# Altium schematic sheet anafun.SchDoc
size A4
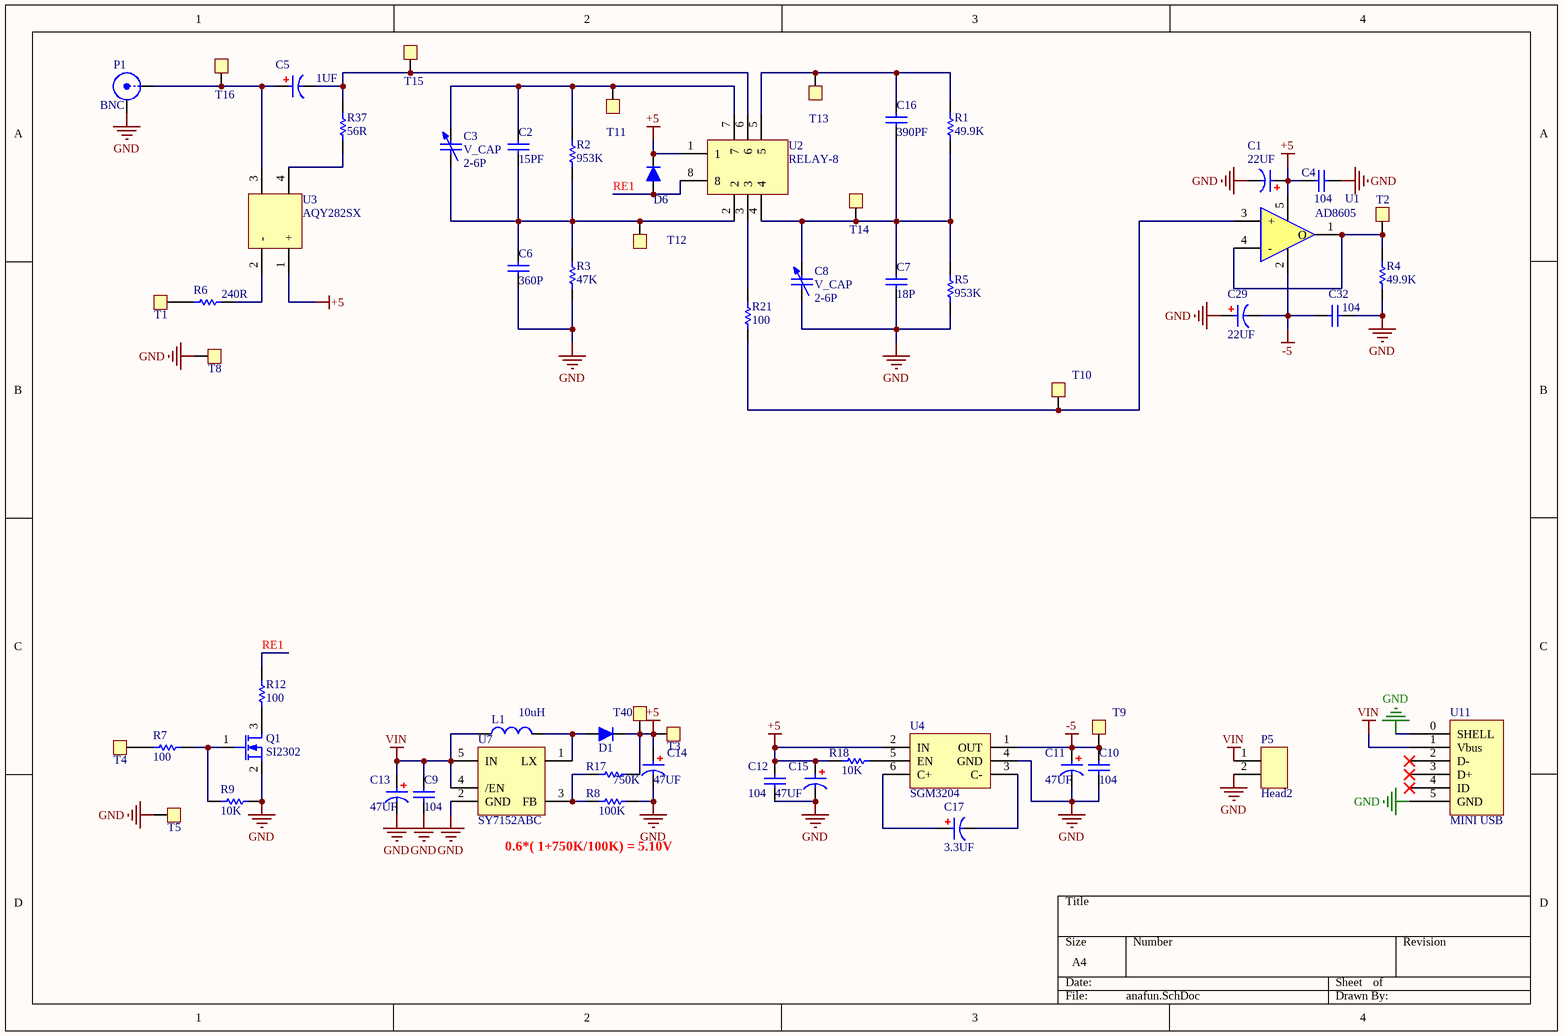
[diagram p0: anafun.SchDoc]

## Parts
C1  22UF  [0603C]
C2  15PF  [0603C]
C3  V_CAP  value 2-6P  [V-CAP]
C4  C104  [0603C]  (value not drawn)
C5  1UF  [1812]
C6  360P  [0603C]
C7  18P  [0603C]
C8  V_CAP  value 2-6P  [V-CAP]
C9  C104  [0603C]  (value not drawn)
C10  C104  [0603C]  (value not drawn)
C11  47UF  [CAP-T-3216]
C12  C104  [0603C]  (value not drawn)
C13  47UF  [CAP-T-3216]
C14  47UF  [CAP-T-3216]
C15  47UF  [CAP-T-3216]
C16  390PF  [0603C]
C17  3.3UF  [0603C]
C29  22UF  [0603C]
C32  C104  [0603C]  (value not drawn)
D1  1N5918WS  [SOD23-322F]  (value not drawn)
D6  BAT54WS  [LC-SOD-323F]  (value not drawn)
L1  10uH  [0805]
P1  BNC  [BNC-OSC]
P5  Head2  [HEAD2]
Q1  SI2302  [SOT-23-3]
R1  49.9K  [0603R]
R2  953K  [0603R]
R3  47K  [0603R]
R4  49.9K  [0603R]
R5  953K  [0603R]
R6  240R  [0603R]
R7  R100R  [0603R]  (value not drawn)
R8  100K  [0603R]
R9  R10K  [0603R]  (value not drawn)
R12  R100R  [0603R]  (value not drawn)
R17  750K  [0603R]
R18  R10K  [0603R]  (value not drawn)
R21  R100R  [0603R]  (value not drawn)
R37  56R  [0603R]
T1  TP  [TEST_POINT]  (value not drawn)
T2  TP  [TEST_POINT]  (value not drawn)
T3  TP  [TEST_POINT]  (value not drawn)
T4  TP  [TEST_POINT]  (value not drawn)
T5  TP  [TEST_POINT]  (value not drawn)
T8  TP  [TEST_POINT]  (value not drawn)
T9  TP  [TEST_POINT]  (value not drawn)
T10  TP  [TEST_POINT]  (value not drawn)
T11  TP  [TEST_POINT]  (value not drawn)
T12  TP  [TEST_POINT]  (value not drawn)
T13  TP  [TEST_POINT]  (value not drawn)
T14  TP  [TEST_POINT]  (value not drawn)
T15  TP  [TEST_POINT]  (value not drawn)
T16  TP  [TEST_POINT]  (value not drawn)
T40  TP  [TEST_POINT]  (value not drawn)
U1  AD8605  [SOT23-5]
U2  RELAY-8  [RELAY-GS6-8]
U3  AQY282SX  [SOP4]
U4  SGM3204  [SOT23-6]
U7  SY7152ABC  [SOT23-6]
U11  MINI USB  [Micro_USB_t]

## Nets
+5: C1.1 C4.1 C12.1 C14.1 C15.1 D1.2(K) D6.2(K) R17.2 R18.1 T3.1(R) T40.1(R) U1.5(V+) U2.1 U3.1(+) U4.2(IN)
-5: C10.1 C11.1 C29.2 C32.1 T9.1(R) U1.2(V-) U4.1(OUT)
GND: C1.2 C4.2 C6.2 C7.2 C8.1 C9.2 C10.2 C11.2 C12.2 C13.2 C14.2 C15.2 C29.1 C32.2 P1.2(Y) P5.2 Q1.2(S) R3.2 R4.2 R5.2 R8.1 R9.2 T5.1(R) T8.1(R) U4.4(GND) U7.2(GND) U11.0(SHELL) U11.5(GND)
VIN: C9.1 C13.1 L1.1 P5.1 U7.4(/EN) U7.5(IN) U11.1(Vbus)
RE1: D6.1(A) R12.1 U2.8
NetC2_1: C2.1 C3.2 R2.1 T11.1(R) U2.7
NetC2_2: C2.2 C3.1 C6.1 R2.2 R3.1 T12.1(R) U2.2
NetC5_1: C5.1 P1.1(X) T16.1(R) U3.3
NetC5_2: C5.2 R37.1 T15.1(R) U2.6
NetC7_1: C7.1 C8.2 C16.2 R1.2 R5.1 T14.1(R) U2.4
NetC16_1: C16.1 R1.1 T13.1(R) U2.5
NetC17_1: C17.1 U4.6(C+)
NetC17_2: C17.2 U4.3(C-)
NetD1_1: D1.1(A) L1.2 U7.1(LX)
NetQ1_1: Q1.1(G) R7.2 R9.1
NetQ1_3: Q1.3(D) R12.2
NetR4_1: R4.1 T2.1(R) U1.1(O) U1.4(-)
NetR6_1: R6.1 T1.1(R)
NetR6_2: R6.2 U3.2(-)
NetR7_1: R7.1 T4.1(R)
NetR8_2: R8.2 R17.1 U7.3(FB)
NetR18_2: R18.2 U4.5(EN)
NetR21_1: R21.1 U2.3
NetR21_2: R21.2 T10.1(R) U1.3(+)
NetR37_2: R37.2 U3.4

Not connected (* = marked no-connect by the designer): U7 6; U11 2(D-)* 3(D+)* 4(ID)*

## Notes on the sheet
- 0.6*( 1+750K/100K) = 5.10V
- (in symbol C0.1uF) 104
- (in symbol R10K) 10K
- (in symbol R100R) 100

## Library data of the parts
C1 C5 C11 C13-C15 C17 C29 = C10uF: 贴片电容
C2 C4 C6 C7 C9 C10 C12 C16 C32 = C0.1uF: 贴片电容
C3 C8 = Cap Var: Variable or Adjustable Capacitor; Published: 24-Mar-1999; LatestRevisionDate: 29-May-2009; LatestRevisionNote: IPC-7351 Footprint Added.; PackageReference: C1210; Publisher: Altium Limited; PackageDescription: Chip Capacitor 1210 Case Size; Code_JEITA: 1210; Code_IPC: CAPC3225
D1 D6 = Diode
L1 = Inductor-100uH
P1 = BNC: BNC Elbow Connector; LatestRevisionDate: 17-Jul-2002; LatestRevisionNote: Re-released for DXP Platform.; Publisher: Altium Limited
Q1 = MOSFET-N
R1-R6 R8 R17 R37 = R1M